# Altium schematic sheet Panasonic_opto_switch.SchDoc
size A4
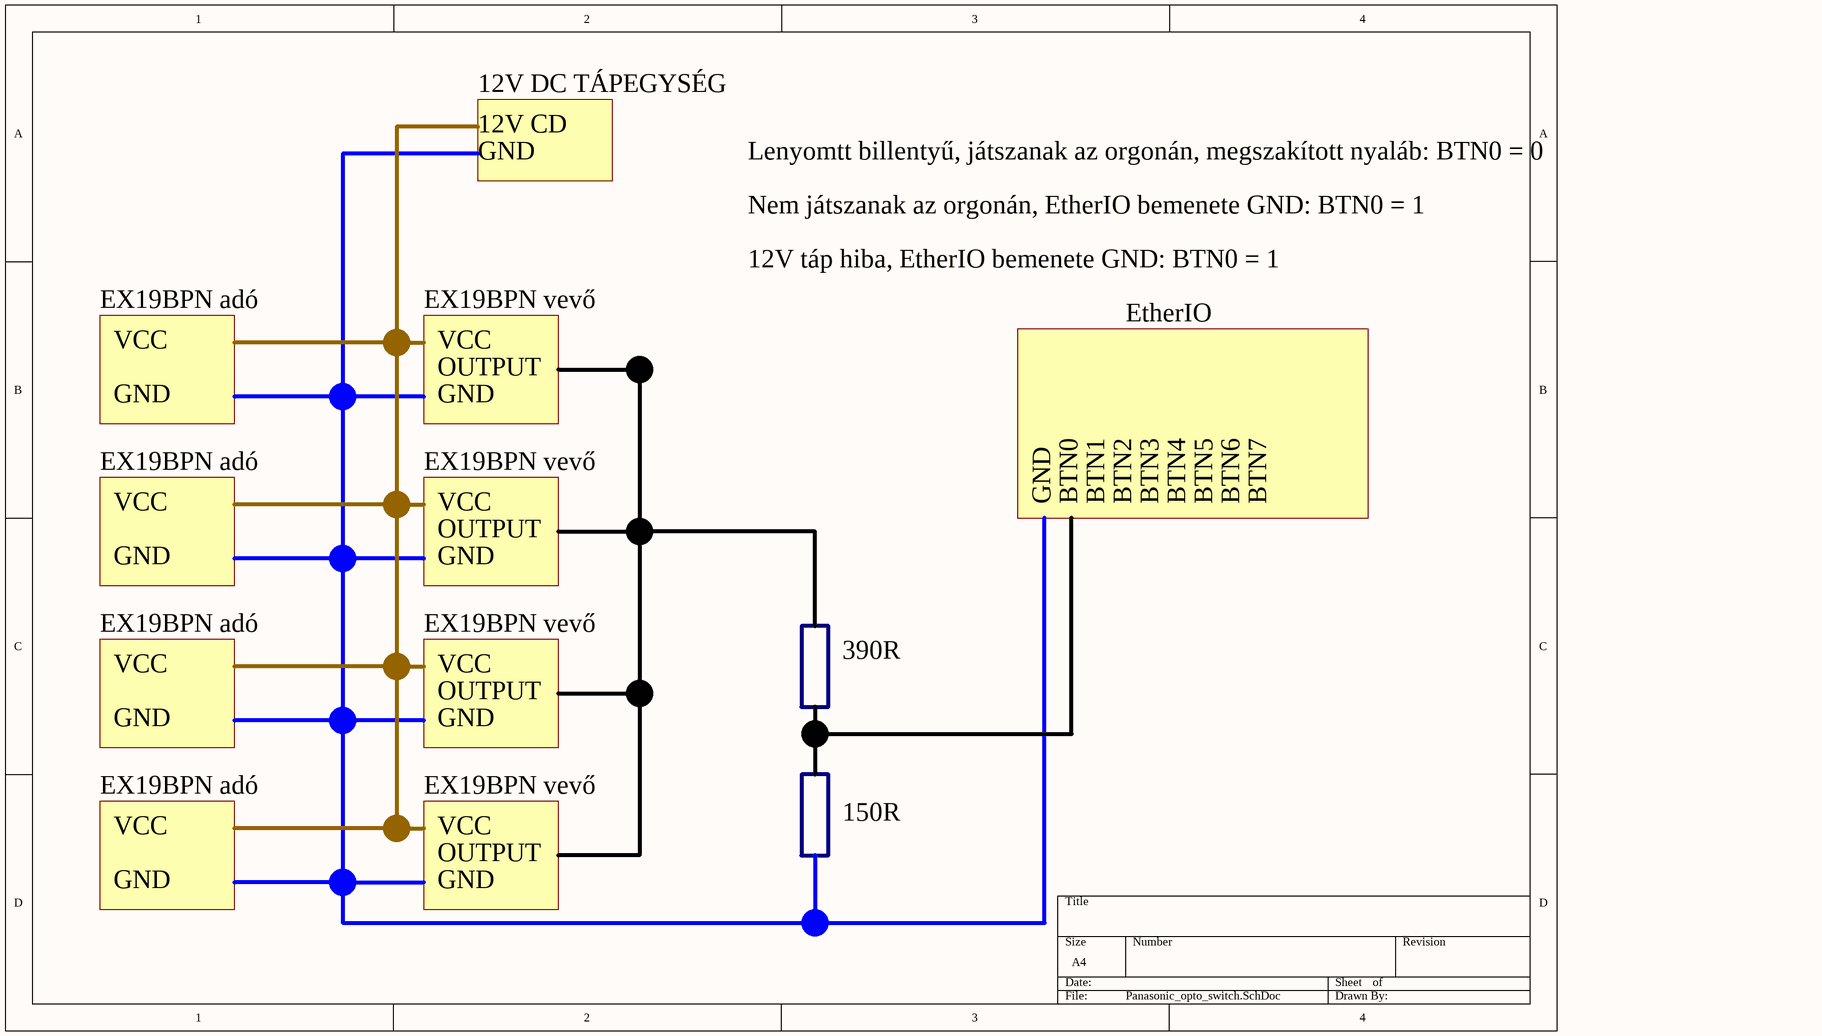
[diagram p0: Panasonic_opto_switch.SchDoc]

## Notes on the sheet
- 12V DC TÁPEGYSÉG
- GND
- 12V CD
- Lenyomtt billentyű, játszanak az orgonán, megszakított nyaláb: BTN0 = 0
- Nem játszanak az orgonán, EtherIO bemenete GND: BTN0 = 1
- EX19BPN adó
- EX19BPN vevő
- 12V táp hiba, EtherIO bemenete GND: BTN0 = 1
- VCC
- OUTPUT
- EtherIO
- BTN0
- BTN1
- BTN2
- BTN3
- BTN4
- BTN5
- BTN6
- BTN7
- 390R
- 150R